# EAGLE schematic Schematic (EAGLE 7.7.0)
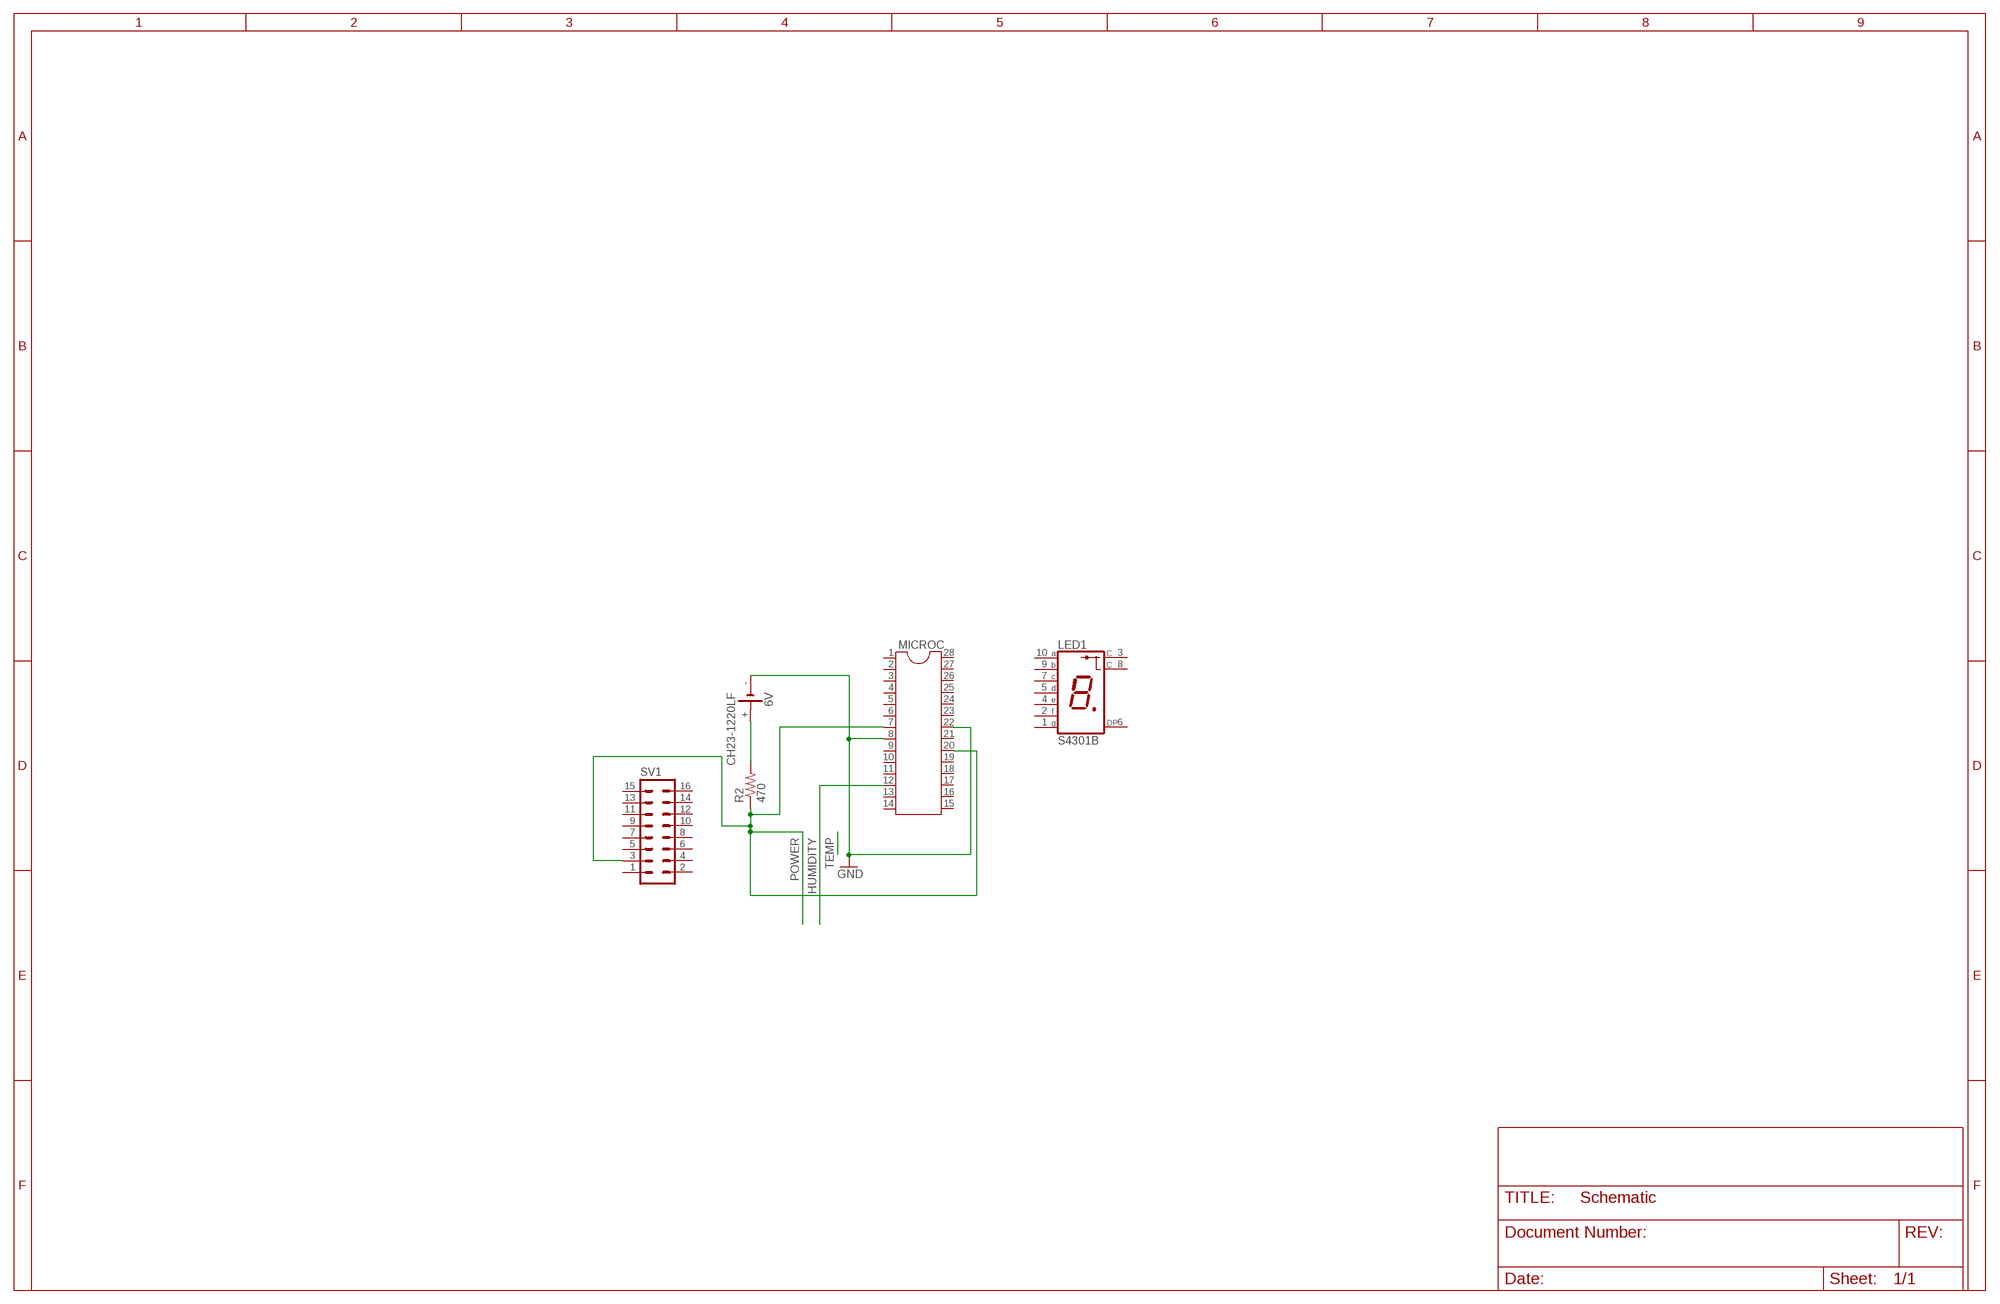
[diagram p0: schematic, sheet 1]

## Parts
6V  CH23-1220LF  [CH23-1220LF]
LED1  S4301B  [S4301B]
MICROC  DIL28  [DIL28-6]
R2  470  R-US_0204/2V  [0204V]
SV1  16PL  [16PL]

## Nets
GND: 6V.- MICROC.8 MICROC.22
HUMIDITY: MICROC.12
N$1: 6V.+ R2.2
POWER: MICROC.7 MICROC.20 R2.1 SV1.3
Unconnected: LED1.1(G) LED1.2(F) LED1.3(C) LED1.4(E) LED1.5(D) LED1.6(DP) LED1.7(C) LED1.8(C) LED1.9(B) LED1.10(A) MICROC.1 MICROC.2 MICROC.3 MICROC.4 MICROC.5 MICROC.6 MICROC.9 MICROC.10 MICROC.11 MICROC.13 MICROC.14 MICROC.15 MICROC.16 MICROC.17 MICROC.18 MICROC.19 MICROC.21 MICROC.23 MICROC.24 MICROC.25 MICROC.26 MICROC.27 MICROC.28 SV1.1 SV1.2 SV1.4 SV1.5 SV1.6 SV1.7 SV1.8 SV1.9 SV1.10 SV1.11 SV1.12 SV1.13 SV1.14 SV1.15 SV1.16

## Library data of the parts
6V = battery:CH23-1220LF: Battary Holder, DIP, 12mm multicomp PART NO. CH-1220LF Source: Data sheet <http://www.farnell.com/datasheets/1505861.pdf>
LED1 = led-7-segment:S4301B: Single Digit Seven-Segment Display (cathode common) Source: LITEON .. S4301B.pdf; OC_FARNELL: unknown; OC_NEWARK: unknown
MICROC = ic-package:DIL28: Dual In Line
R2 = rcl:R-US_: RESISTOR, American symbol
SV1 = con-dil:16PL: DIL CABLE CONNECTOR